# Altium project PCB_Project.PrjPcb
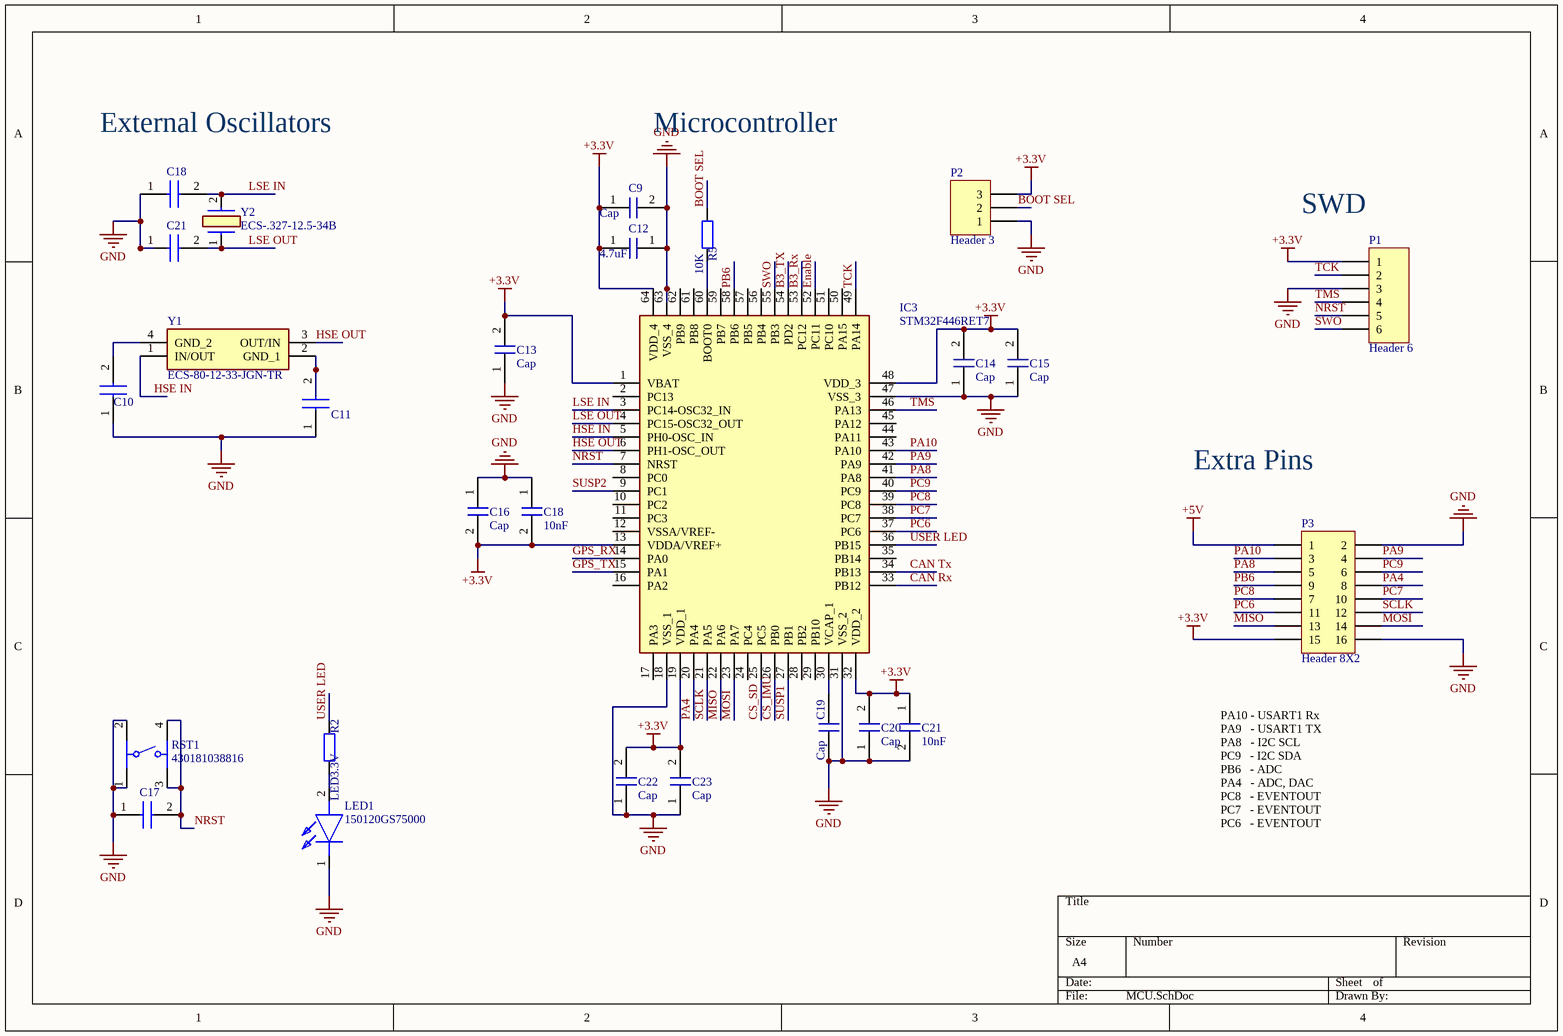
[diagram p0: MCU.SchDoc]
4 sheets, 72 parts. Net scope: global (net labels, ports and power ports of the same name join across sheets).
Board file: PCB.PcbDoc
Sheets:
  MCU.SchDoc
  Supply.SchDoc
  Componentes.SchDoc
  CAN.SchDoc

## Sheet MCU.SchDoc
size A4; SheetNumber: 1; SheetTotal: 1

### Parts
(Parts that share a designator on the sheet are numbered #1, #2 ... from top to bottom, then left to right.)
C9  Cap  [C 0805]
C10  885012207126  [CAPC1608X90N]  (value not drawn)
C11  885012207126  [CAPC1608X90N]  (value not drawn)
C12  4.7uF  [C 1206]
C13  Cap  [C 1206]
C14  Cap  [C 0805]
C15  Cap  [C 1206]
C16  Cap  [C 0805]
C17  06035C104JAT2A  [C 1206]  (value not drawn)
C18#1  885012207126  [CAPC1608X90N]  (value not drawn)
C18#2  10nF  [C 0805P]
C19  Cap  [C 0805]
C20  Cap  [C 1206]
C21#1  885012207126  [CAPC1608X90N]  (value not drawn)
C21#2  10nF  [C 0805P]
C22  Cap  [C 1206]
C23  Cap  [C 1206]
IC3  STM32F446RET7  [Pins 1.2mm]
LED1  150120GS75000  [LEDC3214X78N]
P1  Header 6  [HDR1X6]
P2  Header 3  [HDR1X3]
P3  Header 8X2  [HDR2X8]
R2  LED3.3V  [R 0805]
R5  10K  [R 0805]
RST1  430181038816  [430181038816]
Y1  ECS-80-12-33-JGN-TR  [ECS801233JGNTR]
Y2  ECS-.327-12.5-34B  [ECX-31B]

### Nets
+3.3V: C9.1 C12.1 C13.2 C14.2 C15.2 C16.2 C18#2.2 C20.2 C21#2.1 C22.2 C23.2 IC3.1(VBAT) IC3.13(VDDA/VREF+) IC3.19(VDD_1) IC3.32(VDD_2) IC3.48(VDD_3) IC3.64(VDD_4) P1.1 P2.3 P3.15  [project net VIO]
+5V: P3.1  [project net VCC]
GND: C9.2 C10.1 C11.1 C12.1 C13.1 C14.1 C15.1 C16.1 C17.1 C18#1.1 C18#2.1 C19.1 C20.1 C21#1.1 C21#2.2 C22.1 C23.1 IC3.18(VSS_1) IC3.31(VSS_2) IC3.47(VSS_3) IC3.63(VSS_4) LED1.1(K) P1.3 P2.1 P3.2 P3.16 RST1.1 RST1.2
B3_Rx: IC3.53(PC12)
B3_TX: IC3.54(PD2)
BOOT SEL: P2.2 R5.2
CAN Rx: IC3.33(PB12)
CAN Tx: IC3.34(PB13)
CS_IMU: IC3.26(PB0)
CS_SD: IC3.25(PC5)
Enable: IC3.52(PC11)
GPS_RX: IC3.14(PA0)
GPS_TX: IC3.15(PA1)
HSE IN: IC3.5(PH0-OSC_IN) Y1.1(IN/OUT)
HSE OUT: IC3.6(PH1-OSC_OUT) Y1.3(OUT/IN)
LSE IN: C18#1.2 IC3.3(PC14-OSC32_IN) Y2.2
LSE OUT: C21#1.2 IC3.4(PC15-OSC32_OUT) Y2.1
MISO: IC3.22(PA6) P3.13
MOSI: IC3.23(PA7) P3.14
NRST: C17.2 IC3.7(NRST) P1.5 RST1.3 RST1.4
PA4: IC3.20(PA4) P3.8
PA8: IC3.41(PA8) P3.5
PA9: IC3.42(PA9) P3.4
PA10: IC3.43(PA10) P3.3
PB6: IC3.58(PB6) P3.9
PC6: IC3.37(PC6) P3.11
PC7: IC3.38(PC7) P3.10
PC8: IC3.39(PC8) P3.7
PC9: IC3.40(PC9) P3.6
SCLK: IC3.21(PA5) P3.12
SUSP1: IC3.27(PB1)
SUSP2: IC3.9(PC1)
SWO: IC3.55(PB3) P1.6
TCK: IC3.49(PA14) P1.2
TMS: IC3.46(PA13) P1.4
USER LED: IC3.36(PB15) R2.2
NetC10_2: C10.2 Y1.4(GND_2)
NetC11_2: C11.2 Y1.2(GND_1)
NetC19_1: C19.1 IC3.30(VCAP_1)
NetIC3_60: IC3.60(BOOT0) R5.1
NetLED1_2: LED1.2(A) R2.1

Not connected (* = marked no-connect by the designer): IC3 2(PC13) 8(PC0) 10(PC2) 11(PC3) 12(VSSA/VREF-) 16(PA2) 17(PA3) 24(PC4) 28(PB2) 29(PB10) 35(PB14) 44(PA11) 45(PA12) 50(PA15) 51(PC10) 56(PB4) 57(PB5) 59(PB7) 61(PB8) 62(PB9)

### Notes on the sheet
- External Oscillators
- Microcontroller
- (near P1) SWD
- Extra Pins
- PA10 - USART1 Rx
  PA9   - USART1 TX
  PA8   - I2C SCL
  PC9   - I2C SDA
  PB6   - ADC
  PA4   - ADC, DAC
  PC8   - EVENTOUT
  PC7   - EVENTOUT
  PC6   - EVENTOUT

### Library data of the parts
C9 C12-C16 C18#2 C19 C20 C21#2 C22 C23 = Condensador
C10 C11 C18#1 C21#1 = 885012207126: Capacitor; Manufacturer_Name: Wurth Elektronik; Datasheet Link: https://katalog.we-online.com/pbs/datasheet/885012207126.pdf; Height: 1.35mm; Manufacturer_Part_Number: 885012207126; Mouser Part Number: 710-885012207126; Mouser Price/Stock: https://www.mouser.co.uk/ProductDetail/Wurth-Elektronik/885012207126?qs=MLItCLRbWsx1mdA6iQ1T9Q%3D%3D
C17 = 06035C104JAT2A: Capacitor; Manufacturer_Name: AVX; Datasheet Link: http://www.mouser.com/catalog/supplier/library/pdf/AVXSurfaceMountCeramic.pdf; Height: 0.9mm; Manufacturer_Part_Number: 06035C104JAT2A; Mouser Part Number: 581-06035C104JAT2A; Mouser Price/Stock: https://www.mouser.co.uk/ProductDetail/AVX/06035C104JAT2A/?qs=EbDiPP9peV%252BVb%2FIEcsjONQ%3D%3D; Arrow Part Number: 06035C104JAT2A; Arrow Price/Stock: https://www.arrow.com/en/products/06035c104jat2a/avx
IC3 = STM32F446RET7: Integrated Circuit; Manufacturer_Name: STMicroelectronics; Datasheet Link: https://componentsearchengine.com/Datasheets/5/STM32F446RET7.pdf; Height: 1.6mm; Manufacturer_Part_Number: STM32F446RET7; Mouser Part Number: 511-STM32F446RET7; Mouser Price/Stock: https://www.mouser.co.uk/ProductDetail/STMicroelectronics/STM32F446RET7?qs=qzCNEk%252BRr%252BZ3vIhuSM4Ejg%3D%3D; Arrow Part Number: STM32F446RET7; Arrow Price/Stock: https://www.arrow.com/en/products/stm32f446ret7/stmicroelectronics?region=nac
LED1 = 150120GS75000: LED; Manufacturer_Name: Wurth Elektronik; Height: 0.78mm; Manufacturer_Part_Number: 150120GS75000; Mouser Part Number: 710-150120GS75000; Mouser Price/Stock: https://www.mouser.co.uk/ProductDetail/Wurth-Elektronik/150120GS75000?qs=LlUlMxKIyB3I3AMxrmBw4A%3D%3D
P1 = Header 6: Header, 6-Pin; LatestRevisionDate: 17-Jul-2002; LatestRevisionNote: Re-released for DXP Platform.; Publisher: Altium Limited
P2 = Header 3: Header, 3-Pin; LatestRevisionDate: 17-Jul-2002; LatestRevisionNote: Re-released for DXP Platform.; Publisher: Altium Limited
P3 = Header 8X2: Header, 8-Pin, Dual row; LatestRevisionDate: 17-Jul-2002; LatestRevisionNote: Re-released for DXP Platform.; Publisher: Altium Limited
R2 R5 = 560050320011: WRIS-KSKE SMT Thick Film Resistor, size 0805, 1Ohm, 0.33W; Manufacturer: Wurth Elektronik; Rated Current: 0.57A; Temperature Coefficient of Resistance: +/-100ppm/degC; Technical Reference: KE08051R00F103KAATP0000; Resistance Tolerance: +/-1%; ComponentLink1Description: Manufacturer; ComponentLink1URL: http://www.we-online.de; ComponentLink2Description: Datasheet; ComponentLink2URL: https://www.we-online.com/catalog/datasheet/560050320011.pdf; Published Date: May 2020; Rated Power: 0.33W; Resistance: 1Ohm; Height: 0.6mm; Operating Temperature: -55 to +155degC; Mounting Technology: SMT; Packaging: Tape and Reel; Size: 0805; Length: 2mm; Manufacturer Part Number: 560050320011; Width: 1.25mm
RST1 = 430181038816: WS-TASV SMT Tact Switch 4.5x4.5mm, height 3.8mm, 160gf; Rated Voltage: 12VDC; Rated Current: 50mA; Washable: No; ComponentLink1Description: Manufacturer; ComponentLink1URL: http://www.we-online.de; ComponentLink2Description: Datasheet; ComponentLink2URL: https://katalog.we-online.com/em/datasheet/430181038816.pdf; Operating Temperature: -40 to +85degC; Part Number: 430181038816; Published Date: September 2019; Contact Material: Stainless Steel; Height: 3.8mm; Mounting Technology: SMT; Contact Plating: Silver; Operation Force: 160gf; Packaging: Tape and Reel; Terminal Material: Copper Alloy; Publisher: Wurth Elektronik; Terminal Plating: Silver
Y1 = ECS-80-12-33-JGN-TR: Crystal or Oscillator; Manufacturer_Name: ECS; Datasheet Link: https://ecsxtal.com/store/pdf/ecx-32.pdf; Height: 0.8mm; Manufacturer_Part_Number: ECS-80-12-33-JGN-TR; Mouser Part Number: 520-80-12-33-JGN-TR; Mouser Price/Stock: https://www.mouser.co.uk/ProductDetail/ECS/ECS-80-12-33-JGN-TR?qs=d0WKAl%252BL4KaVcQK0q%252BTt4Q%3D%3D; Arrow Part Number: ECS-80-12-33-JGN-TR; Arrow Price/Stock: https://www.arrow.com/en/products/ecs-80-12-33-jgn-tr/ecs-international?region=nac
Y2 = ECS-.327-12.5-34B: Crystal or Oscillator; Manufacturer_Name: ECS; Datasheet Link: https://componentsearchengine.com/Datasheets/1/ECS-.327-12.5-34B.pdf; Manufacturer_Part_Number: ECS-.327-12.5-34B; Mouser Part Number: 520-ECS-327-12.5-34B; Mouser Price/Stock: https://www.mouser.co.uk/ProductDetail/ECS/ECS-.327-12.5-34B?qs=muFWWzTLGEJ4ncukpyY8Bw%3D%3D

## Sheet Supply.SchDoc
size A4
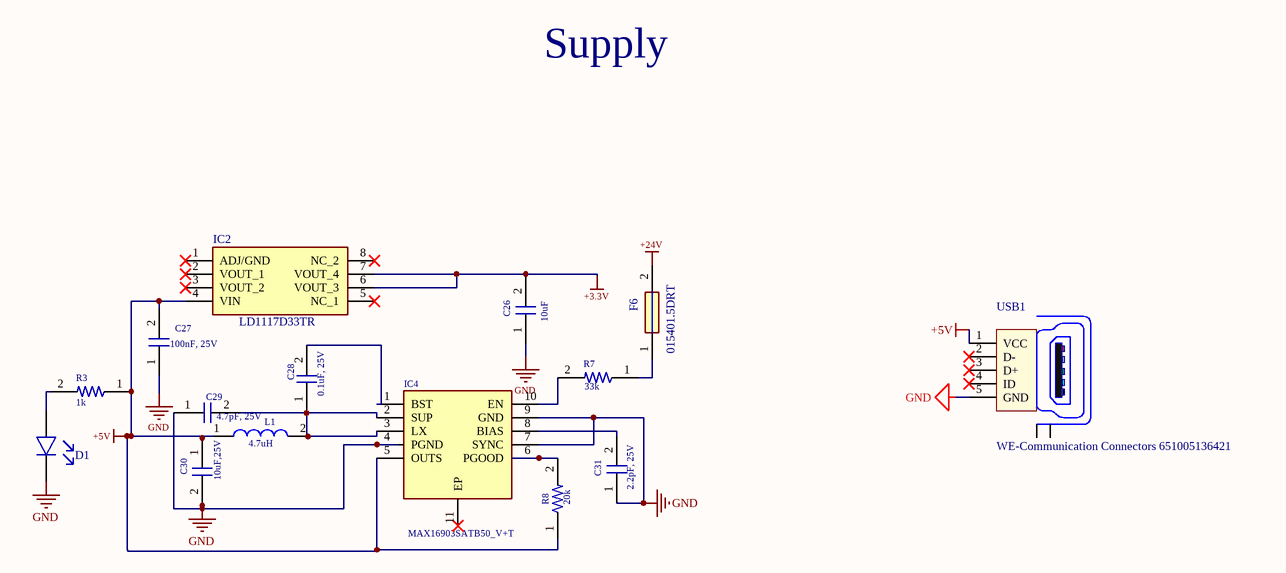
[diagram p1: Supply.SchDoc]

### Parts
C26  10uF  [C 1206]
C27  100nF, 25V  [C 1206]
C28  0.1uF, 25V  [C 1206]
C29  4.7pF, 25V  [C 1206]
C30  10uF,25V  [C 1206]
C31  2.2pF, 25V  [C 1206]
D1  Valor  [LED 0805]  (value not drawn)
F6  015401.5DRT  [Fuse Holder]
IC2  LD1117D33TR  [SOIC127P600X175-8N]
IC4  MAX16903SATB50_V+T  [SON50P300X300X80-11N]
L1  4.7uH  [MPX1D0530L150]
R3  1k  [R 0201]
R7  33k  [R 0805]
R8  20k  [R 0805]
USB1  WE-Communication Connectors 651005136421  [65100516121]

### Nets
+3.3V: C26.2 IC2.6(VOUT_3) IC2.7(VOUT_4)  [project net VIO]
+5V: C27.2 C30.1 IC2.4(VIN) IC4.5(OUTS) L1.1 R3.1 R8.1 USB1.1(VCC)  [project net VCC]
+24V: F6.2
GND: C26.1 C27.1 C29.1 C30.2 C31.1 D1.1 IC4.4(PGND) IC4.7(SYNC) IC4.9(GND) USB1.5(GND)
NetC28_1: C28.1 C29.2 IC4.2(SUP) IC4.3(LX) L1.2
NetC28_2: C28.2 IC4.1(BST)
NetC31_2: C31.2 IC4.8(BIAS)
NetD1_2: D1.2 R3.2
NetF6_1: F6.1 R7.1
NetIC4_6: IC4.6(PGOOD) R8.2
NetIC4_10: IC4.10(EN) R7.2

Not connected (* = marked no-connect by the designer): IC2 1(ADJ/GND)* 2(VOUT_1)* 3(VOUT_2)* 5(NC_1)* 8(NC_2)*; IC4 11(EP)*; USB1 2(D-)* 3(D+)* 4(ID)* Z1(Shield) Z2(Shield)

### Notes on the sheet
- Supply

### Library data of the parts
C26-C31 = Condensador
D1 = LED
F6 = 015401.5DRT: Fuse; Manufacturer_Name: LITTELFUSE; Datasheet Link: https://componentsearchengine.com/Datasheets/2/015401.5DRT.pdf; Height: 3.81mm; Manufacturer_Part_Number: 015401.5DRT; Mouser Part Number: 576-015401.5DRT; Mouser Price/Stock: https://www.mouser.co.uk/ProductDetail/Littelfuse/015401.5DRT?qs=gu7KAQ731USSn8iq6YrVPw%3D%3D; Arrow Part Number: 015401.5DRT; Arrow Price/Stock: https://www.arrow.com/en/products/015401.5drt/littelfuse?region=nac
IC2 = LD1117D33TR: Integrated Circuit; Manufacturer_Name: STMicroelectronics; Datasheet Link: http://www.st.com/st-web-ui/static/active/en/resource/technical/document/datasheet/CD00000544.pdf; Height: 1.75mm; Manufacturer_Part_Number: LD1117D33TR; Mouser Part Number: 511-LD1117D33-TR; Mouser Price/Stock: https://www.mouser.co.uk/ProductDetail/STMicroelectronics/LD1117D33TR?qs=8YYpzd7qSxIl%2FiC6F%2FA2nA%3D%3D; Arrow Part Number: LD1117D33TR; Arrow Price/Stock: https://www.arrow.com/en/products/ld1117d33tr/stmicroelectronics
IC4 = MAX16903SATB50_V+T: Integrated Circuit; Manufacturer_Name: Maxim Integrated; Manufacturer_Part_Number: MAX16903SATB50/V+T; Datasheet Link: https://pdfserv.maximintegrated.com/en/ds/MAX16903.pdf; Height: 0.8mm
L1 = Inductor
R3 R7 R8 = Resistencia
USB1 = WE-Communication Connectors 651005136421: WR-COM Mini USB Vertical TH Type B 5 Contacts; Manufacturer: Würth Elektronik eiSos GmbH; ComponentLink1 Description: Manufacturer; ComponentLink2 Description: Datasheet; NoPins: 5; ComponentLink1URL: http://www.we-online.de; ComponentLink2URL: http://katalog.we-online.de/em/datasheet/651005136421.pdf; Created by: Karrer Zheng; Created Date: 10/10/2014; partNo: 651005136421

## Sheet Componentes.SchDoc
size A4
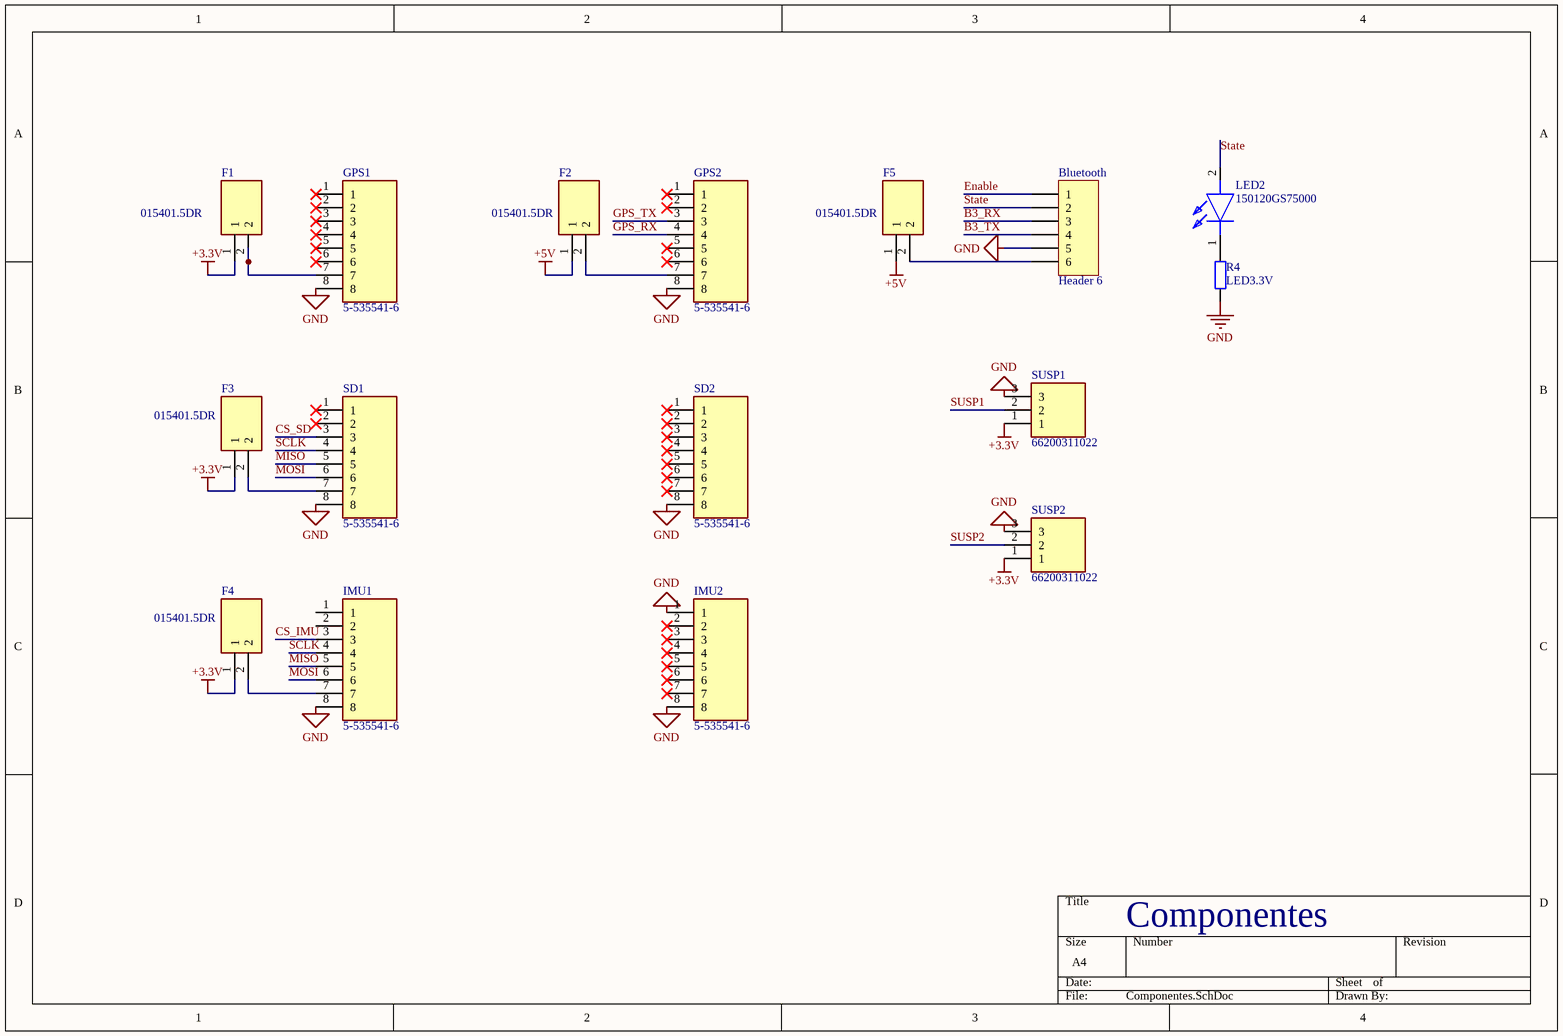
[diagram p2: Componentes.SchDoc]

### Parts
Bluetooth  Header 6  [HDR1X6]
F1  015401.5DR  [Fuse Holder]
F2  015401.5DR  [Fuse Holder]
F3  015401.5DR  [Fuse Holder]
F4  015401.5DR  [Fuse Holder]
F5  015401.5DR  [Fuse Holder]
GPS1  5-535541-6  [RHDR8W60P0X254_1X8_2082X250X850P]
GPS2  5-535541-6  [RHDR8W60P0X254_1X8_2082X250X850P]
IMU1  5-535541-6  [RHDR8W60P0X254_1X8_2082X250X850P]
IMU2  5-535541-6  [RHDR8W60P0X254_1X8_2082X250X850P]
LED2  150120GS75000  [LEDC3214X78N]
R4  LED3.3V  [R 0805]
SD1  5-535541-6  [RHDR8W60P0X254_1X8_2082X250X850P]
SD2  5-535541-6  [RHDR8W60P0X254_1X8_2082X250X850P]
SUSP1  66200311022  [66200311022]
SUSP2  66200311022  [66200311022]

### Nets
+3.3V: F1.1 F3.1 F4.1 SUSP1.1 SUSP2.1  [project net VIO]
+5V: F2.1 F5.1  [project net VCC]
GND: Bluetooth.5 GPS1.8 GPS2.8 IMU1.8 IMU2.1 IMU2.8 R4.1 SD1.8 SD2.8 SUSP1.3 SUSP2.3
B3_Rx: Bluetooth.3
B3_TX: Bluetooth.4
CS_IMU: IMU1.3
CS_SD: SD1.3
Enable: Bluetooth.1
GPS_RX: GPS2.4
GPS_TX: GPS2.3
MISO: IMU1.5 SD1.5
MOSI: IMU1.6 SD1.6
SCLK: IMU1.4 SD1.4
State: Bluetooth.2 LED2.2(A)
SUSP1: SUSP1.2
SUSP2: SUSP2.2
NetBluetooth_6: Bluetooth.6 F5.2
NetF1_2: F1.2 GPS1.7
NetF2_2: F2.2 GPS2.7
NetF3_2: F3.2 SD1.7
NetF4_2: F4.2 IMU1.7
NetLED2_1: LED2.1(K) R4.2

Not connected (* = marked no-connect by the designer): GPS1 1* 2* 3* 4* 5* 6*; GPS2 1* 2* 5* 6*; IMU1 1 2; IMU2 2* 3* 4* 5* 6* 7*; SD1 1* 2*; SD2 1* 2* 3* 4* 5* 6* 7*

### Notes on the sheet
- Componentes

### Library data of the parts
Bluetooth = Header 6: Header, 6-Pin; LatestRevisionDate: 17-Jul-2002; LatestRevisionNote: Re-released for DXP Platform.; Publisher: Altium Limited
F1-F5 = 015401.5DR: Fuse; Manufacturer_Name: LITTELFUSE; Allied_Number: 70519132; Datasheet Link: https://www.littelfuse.com/~/media/electronics/datasheets/fuses/littelfuse_fuse_154_154t_154l_154tl_datasheet.pdf.pdf; Height: 3.81mm; Manufacturer_Part_Number: 015401.5DR; Mouser Part Number: 576-015401.5DR; Mouser Price/Stock: https://www.mouser.com/Search/Refine.aspx?Keyword=576-015401.5DR; RS Part Number: 7382879P; RS Price/Stock: http://uk.rs-online.com/web/p/products/7382879P; Allied Price/Stock: https://www.alliedelec.com/littelfuse-015401-5dr/70519132/
GPS1 GPS2 IMU1 IMU2 SD1 SD2 = 5-535541-6: Connector Socket Strip RCP 8 POS 2.54mm Solder ST Thru-Hole Gang of Tubes; MF: TE Connectivity; SnapEDA_Link: https://www.snapeda.com/parts/5-535541-6/TE%20Connectivity%20AMP%20Connectors/view-part/497141/?ref=snap; Price: None; Availability: Unavailable; Package: None; Value: *; MP: 5-535541-6
LED2 = 150120GS75000: LED; Manufacturer_Name: Wurth Elektronik; Height: 0.78mm; Manufacturer_Part_Number: 150120GS75000; Mouser Part Number: 710-150120GS75000; Mouser Price/Stock: https://www.mouser.co.uk/ProductDetail/Wurth-Elektronik/150120GS75000?qs=LlUlMxKIyB3I3AMxrmBw4A%3D%3D
R4 = 560050320011_2: WRIS-KSKE SMT Thick Film Resistor, size 0805, 1Ohm, 0.33W; Manufacturer: Wurth Elektronik; Rated Current: 0.57A; Temperature Coefficient of Resistance: +/-100ppm/degC; Technical Reference: KE08051R00F103KAATP0000; Resistance Tolerance: +/-1%; ComponentLink1Description: Manufacturer; ComponentLink1URL: http://www.we-online.de; ComponentLink2Description: Datasheet; ComponentLink2URL: https://www.we-online.com/catalog/datasheet/560050320011.pdf; Published Date: May 2020; Rated Power: 0.33W; Resistance: 1Ohm; Height: 0.6mm; Operating Temperature: -55 to +155degC; Mounting Technology: SMT; Packaging: Tape and Reel; Size: 0805; Length: 2mm; Manufacturer Part Number: 560050320011; Width: 1.25mm
SUSP1 SUSP2 = 66200311022: Connector; Manufacturer_Name: Wurth Elektronik; Datasheet Link: https://docs.rs-online.com/3e1f/A700000007269589.pdf; Height: 5.72mm; Manufacturer_Part_Number: 66200311022; Mouser Part Number: 710-66200311022; Mouser Price/Stock: https://www.mouser.co.uk/ProductDetail/Wurth-Elektronik/66200311022?qs=3RJ0PdSuLVkSi7ZZT4Z8xA%3D%3D

## Sheet CAN.SchDoc
size A4
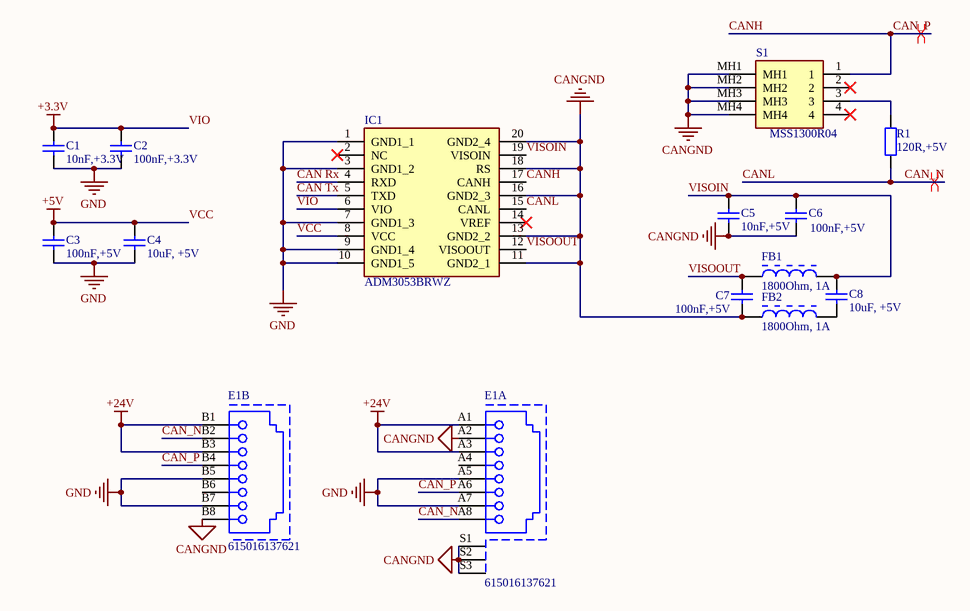
[diagram p3: CAN.SchDoc]

### Parts
C1  10nF,+3.3V  [C 0805]
C2  100nF,+3.3V  [C 1206]
C3  100nF,+5V  [C 1206]
C4  10uF, +5V  [C 1206]
C5  10nF,+5V  [C 0805]
C6  100nF,+5V  [C 1206]
C7  100nF,+5V  [C 1206]
C8  10uF, +5V  [C 1206]
E1  615016137621  [Ethernet2]  (parts A,B of 2)
FB1  1800Ohm, 1A  [F 0805]
FB2  1800Ohm, 1A  [F 0805]
IC1  ADM3053BRWZ  [SOIC127P1032X265-20N]
R1  120R,+5V  [R 0805]
S1  MSS1300R04  [MSS1300R04]

### Nets
+24V: E1.A1 E1.A3 E1.B1 E1.B3
CANGND: C5.1 C6.1 C7.1 E1.A2 E1.B8 E1.S1 E1.S2 E1.S3 FB2.1 IC1.11(GND2_1) IC1.13(GND2_2) IC1.16(GND2_3) IC1.18(RS) IC1.20(GND2_4) S1.MH1 S1.MH2 S1.MH3 S1.MH4
GND: C1.1 C2.1 C3.1 C4.1 E1.A5 E1.A7 E1.B5 E1.B7 IC1.1(GND1_1) IC1.3(GND1_2) IC1.7(GND1_3) IC1.9(GND1_4) IC1.10(GND1_5)
VCC: C3.2 C4.2 IC1.8(VCC)  [also labelled +5V]
VIO: C1.2 C2.2 IC1.6(VIO)  [also labelled +3.3V]
CAN Rx: IC1.4(RXD)
CAN Tx: IC1.5(TXD)
CAN_N: E1.A8 E1.B2 IC1.15(CANL) R1.1  [also labelled CANL]
CAN_P: E1.A6 E1.B4 IC1.17(CANH) S1.1  [also labelled CANH]
VISOIN: C5.2 C6.2 C8.2 FB1.2 IC1.19(VISOIN)
VISOOUT: C7.2 FB1.1 IC1.12(VISOOUT)
NetC8_1: C8.1 FB2.2
NetR1_2: R1.2 S1.3

Not connected (* = marked no-connect by the designer): E1 A4 B6; IC1 2(NC)* 14(VREF)*; S1 2* 4*

### Layout directives
differential pair: CAN_N, CAN_P

### Library data of the parts
C1 C5 = 885012207126_6: WCAP-CSGP Multilayer Ceramic Chip Capacitor, General Purpose, size 0805, X7R, 47nF, 100V; Manufacturer: Wurth Elektronik; Rated Voltage: 100VDC; Isolation Resistance: >=2.1GOhm; Capacitance Tolerance: +/-10%; Technical Reference: X7R0805473K100DFCT10000; ComponentLink1Description: Manufacturer; ComponentLink1URL: http://www.we-online.de; ComponentLink2Description: Datasheet; ComponentLink2URL: https://www.we-online.com/catalog/datasheet/885012207126.pdf; Operating Temperature: -55 to +125degC; Packaging: Tape and Reel; Manufacturer Part Number: 885012207126; Published Date: May 2020; Ceramic Type: X7R; Dissipation Factor: =<2.5%; Height: 1.25mm; Mounting Technology: SMT; Size: 0805; Capacitance: 47nF
C2 = 885012208015_1: WCAP-CSGP General Purpose Ceramic Capacitors, size 1206, 2.2uF, +/-10%, 10VDC; Isolation Resistance: >=0.2GOhm; Ceramic Type: X7R; Technical Reference: X7R1206225K010DFCT10000; ComponentLink1Description: Manufacturer; ComponentLink1URL: http://www.we-online.de; ComponentLink2Description: Datasheet; ComponentLink2URL: https://katalog.we-online.com/pbs/datasheet/885012208015.pdf; Operating Temperature: -55 to +125degC; Packaging: Tape and Reel; Part Number: 885012208015; Publisher: Wurth Elektronik; Rated Voltage: 10VDC; Published Date: August 2019; Capacitance Tolerance: +/-10%; Dissipation Factor: =<10%; Height: 1.15mm +/-0.15mm; Mounting Technology: SMT; Size: 1206; Capacitance: 2.2uF
C3 C6 C7 = 885012208013_4: WCAP-CSGP General Purpose Ceramic Capacitors, size 1206, 1uF, +/-10%, 10VDC; Isolation Resistance: >=0.5GOhm; Ceramic Type: X7R; Technical Reference: X7R1206105K010DFCT10000; ComponentLink1Description: Manufacturer; ComponentLink1URL: http://www.we-online.de; ComponentLink2Description: Datasheet; ComponentLink2URL: https://katalog.we-online.com/pbs/datasheet/885012208013.pdf; Operating Temperature: -55 to +125degC; Packaging: Tape and Reel; Part Number: 885012208013; Publisher: Wurth Elektronik; Rated Voltage: 10VDC; Published Date: August 2019; Capacitance Tolerance: +/-10%; Dissipation Factor: =<5%; Height: 1.15mm +/-0.15mm; Mounting Technology: SMT; Size: 1206; Capacitance: 1uF
C4 C8 = 885012208013_5: WCAP-CSGP General Purpose Ceramic Capacitors, size 1206, 1uF, +/-10%, 10VDC; Isolation Resistance: >=0.5GOhm; Ceramic Type: X7R; Technical Reference: X7R1206105K010DFCT10000; ComponentLink1Description: Manufacturer; ComponentLink1URL: http://www.we-online.de; ComponentLink2Description: Datasheet; ComponentLink2URL: https://katalog.we-online.com/pbs/datasheet/885012208013.pdf; Operating Temperature: -55 to +125degC; Packaging: Tape and Reel; Part Number: 885012208013; Publisher: Wurth Elektronik; Rated Voltage: 10VDC; Published Date: August 2019; Capacitance Tolerance: +/-10%; Dissipation Factor: =<5%; Height: 1.15mm +/-0.15mm; Mounting Technology: SMT; Size: 1206; Capacitance: 1uF
E1 = 615016137621: WR-MJ Modular Jack THT Horizontal Shielded Dual Port 8P8C Tab Down; Rated Current: 1.5A; Contact Resistance: 20mOhm; Insulation Resistance: 500MOhm; Working Voltage: 120VAC; Withstanding Voltage: 1000VAC; ComponentLink1Description: Manufacturer; ComponentLink1URL: http://www.we-online.de; ComponentLink2Description: Datasheet; ComponentLink2URL: https://katalog.we-online.com/em/datasheet/615016137621.pdf; Packaging: Tray; Publisher: Wurth Elektronik; Mounting Technology: THT; Operating Temperature: -40 to +85degC; Part Number: 615016137621; Published Date: November 2019; xPxC: 8P8C; Type: Horizontal
FB1 FB2 = 742792090: WE-CBF SMT EMI Suppression Ferrite Bead, size 0805, 1800Ohm, 1A; Manufacturer: Wurth Elektronik; Impedance max.: 2000Ohm; DC Resistance max.: 0.4Ohm; Type: Wide Band; ComponentLink1Description: Manufacturer; ComponentLink1URL: http://www.we-online.de; ComponentLink2Description: Datasheet; ComponentLink2URL: https://www.we-online.com/catalog/datasheet/742792090.pdf; Operating Temperature: -55 to +125degC; Packaging: Tape and Reel; Published Date: March 2020; Rated Current: 1A; Manufacturer Part Number: 742792090; Impedance @100MHz: 1800Ohm; Mounting Technology: SMT; Size: 0805
IC1 = ADM3053BRWZ: Integrated Circuit; Manufacturer_Name: Analog Devices; Datasheet Link: https://componentsearchengine.com/Datasheets/2/ADM3053BRWZ.pdf; Height: 2.65mm; Manufacturer_Part_Number: ADM3053BRWZ; Mouser Part Number: 584-ADM3053BRWZ; Mouser Price/Stock: https://www.mouser.co.uk/ProductDetail/Analog-Devices/ADM3053BRWZ?qs=BpaRKvA4VqGZYG1hZ9cdqw%3D%3D; Arrow Part Number: ADM3053BRWZ; Arrow Price/Stock: https://www.arrow.com/en/products/adm3053brwz/analog-devices?region=nac
R1 = 560050320011_9: WRIS-KSKE SMT Thick Film Resistor, size 0805, 1Ohm, 0.33W; Manufacturer: Wurth Elektronik; Rated Current: 0.57A; Temperature Coefficient of Resistance: +/-100ppm/degC; Technical Reference: KE08051R00F103KAATP0000; Resistance Tolerance: +/-1%; ComponentLink1Description: Manufacturer; ComponentLink1URL: http://www.we-online.de; ComponentLink2Description: Datasheet; ComponentLink2URL: https://www.we-online.com/catalog/datasheet/560050320011.pdf; Published Date: May 2020; Rated Power: 0.33W; Resistance: 1Ohm; Height: 0.6mm; Operating Temperature: -55 to +155degC; Mounting Technology: SMT; Packaging: Tape and Reel; Size: 0805; Length: 2mm; Manufacturer Part Number: 560050320011; Width: 1.25mm
S1 = MSS1300R04: Switch; Manufacturer_Name: TE Connectivity; Datasheet Link: https://www.te.com/commerce/DocumentDelivery/DDEController?Action=showdoc&DocId=Customer+Drawing%7F1825260%7FA2%7Fpdf%7FEnglish%7FENG_CD_1825260_A2.pdf%7F1825260-1; Height: 11.3mm; Manufacturer_Part_Number: MSS1300R04; Mouser Part Number: 506-MSS1300R04; Mouser Price/Stock: https://www.mouser.co.uk/ProductDetail/TE-Connectivity-PB/MSS1300R04?qs=Of7OaoM7rsFDfSerl70TPw%3D%3D

## Nets that join several sheets
+24V: Supply (F6.2), CAN (E1.A1 E1.A3 E1.B1 E1.B3)
GND: MCU (28 pins), Supply (10 pins), Componentes (11 pins), CAN (13 pins)
VCC: MCU (P3.1), Supply (8 pins), Componentes (F2.1 F5.1), CAN (C3.2 C4.2 IC1.8)
VIO: MCU (20 pins), Supply (C26.2 IC2.6 IC2.7), Componentes (5 pins), CAN (C1.2 C2.2 IC1.6)
B3_Rx: MCU (IC3.53), Componentes (Bluetooth.3)
B3_TX: MCU (IC3.54), Componentes (Bluetooth.4)
CAN Rx: MCU (IC3.33), CAN (IC1.4)
CAN Tx: MCU (IC3.34), CAN (IC1.5)
CS_IMU: MCU (IC3.26), Componentes (IMU1.3)
CS_SD: MCU (IC3.25), Componentes (SD1.3)
Enable: MCU (IC3.52), Componentes (Bluetooth.1)
GPS_RX: MCU (IC3.14), Componentes (GPS2.4)
GPS_TX: MCU (IC3.15), Componentes (GPS2.3)
MISO: MCU (IC3.22 P3.13), Componentes (IMU1.5 SD1.5)
MOSI: MCU (IC3.23 P3.14), Componentes (IMU1.6 SD1.6)
SCLK: MCU (IC3.21 P3.12), Componentes (IMU1.4 SD1.4)
SUSP1: MCU (IC3.27), Componentes (SUSP1.2)
SUSP2: MCU (IC3.9), Componentes (SUSP2.2)